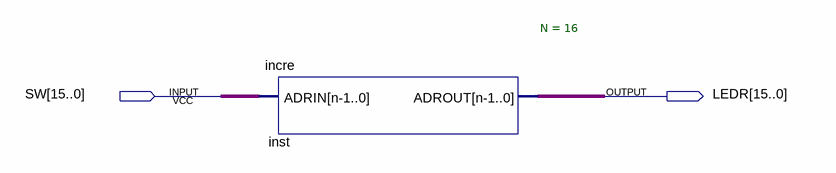
[diagram p0: schematic sheet]
// Quartus schematic test_inc.bdf as structural Verilog: 1 symbols, 2 pins
module test_inc (
  input  [15:0] SW,
  output [15:0] LEDR
);

  incre #(.N(16)) inst (.ADRIN(SW), .ADROUT(LEDR));
endmodule
